# EAGLE design Daughter2 routed (EAGLE 9.6.2)
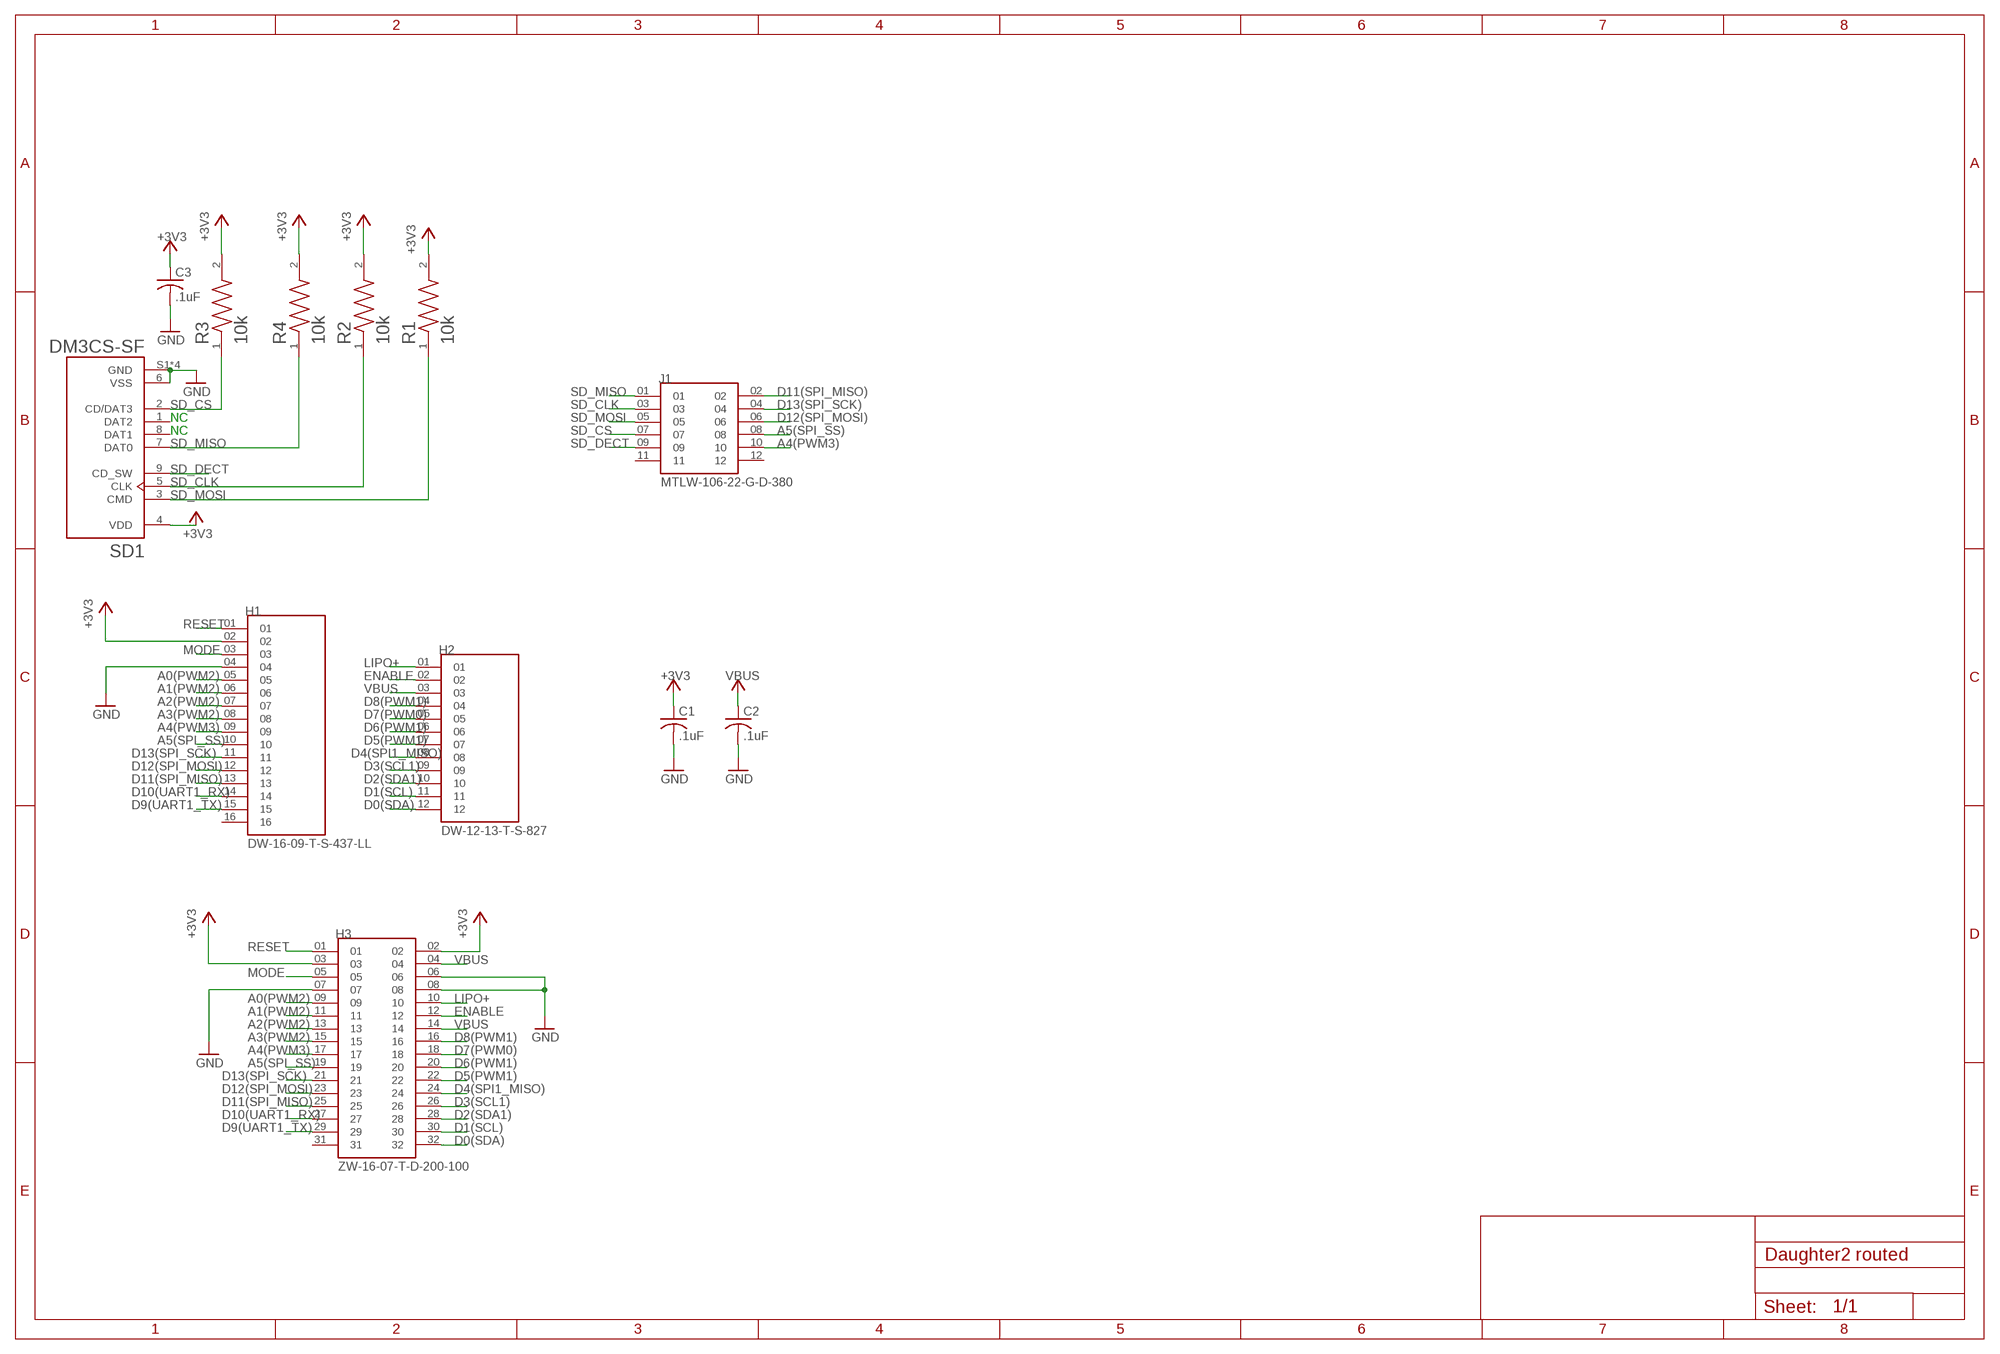
[diagram p0: schematic, sheet 1]

## Parts
C1  .1uF  C-US025-030X050  [C025-030X050]
C2  .1uF  C-US025-030X050  [C025-030X050]
C3  .1uF  C-US025-030X050  [C025-030X050]
H1  DW-16-09-T-S-437-LL  [SAMTEC_DW-16-09-T-S-437-LL]
H2  DW-12-13-T-S-827  [SAMTEC_DW-12-13-T-S-827]
H3  ZW-16-07-T-D-200-100  [SAMTEC_ZW-16-07-T-D-200-100]
J1  MTLW-106-22-G-D-380  [SAMTEC_MTLW-106-22-G-D-380]
R1  10k  1623927-4  [RESAD700W45L350D185]
R2  10k  1623927-4  [RESAD700W45L350D185]
R3  10k  1623927-4  [RESAD700W45L350D185]
R4  10k  1623927-4  [RESAD700W45L350D185]
SD1  DM3CS-SF  [HRS_DM3CS-SF]

## Nets
+3V3: C1.1 C3.1 H1.02 H3.02 H3.03 R1.2 R2.2 R3.2 R4.2 SD1.4(VDD)
A0(PWM2): H1.05 H3.09
A1(PWM2): H1.06 H3.11
A2(PWM2): H1.07 H3.13
A3(PWM2): H1.08 H3.15
A4(PWM3): H1.09 H3.17 J1.10
A5(SPI_SS): H1.10 H3.19 J1.08
D0(SDA): H2.12 H3.32
D1(SCL): H2.11 H3.30
D2(SDA1): H2.10 H3.28
D3(SCL1): H2.09 H3.26
D4(SPI1_MISO): H2.08 H3.24
D5(PWM1): H2.07 H3.22
D6(PWM1): H2.06 H3.20
D7(PWM0): H2.05 H3.18
D8(PWM1): H2.04 H3.16
D9(UART1_TX): H1.15 H3.29
D10(UART1_RX): H1.14 H3.27
D11(SPI_MISO): H1.13 H3.25 J1.02
D12(SPI_MOSI): H1.12 H3.23 J1.06
D13(SPI_SCK): H1.11 H3.21 J1.04
ENABLE: H2.02 H3.12
GND: C1.2 C2.2 C3.2 H1.04 H3.06 H3.07 H3.08 SD1.6(VSS) SD1.S1(GND) SD1.S2(GND) SD1.S3(GND) SD1.S5(GND)
LIPO+: H2.01 H3.10
MODE: H1.03 H3.05
RESET: H1.01 H3.01
SD_CLK: J1.03 R2.1 SD1.5(CLK)
SD_CS: J1.07 R3.1 SD1.2(CD/DAT3)
SD_DECT: J1.09 SD1.9(CD_SW)
SD_MISO: J1.01 R4.1 SD1.7(DAT0)
SD_MOSI: J1.05 R1.1 SD1.3(CMD)
VBUS: C2.1 H2.03 H3.04 H3.14 ; supply symbol labelled VCC
Unconnected: H1.16 H3.31 J1.11 J1.12 SD1.1(DAT2) SD1.8(DAT1)

## Notes on the sheet
- NC
- NC

## Library data of the parts
C1-C3 = rcl:C-US: CAPACITOR, American symbol; SPICEPREFIX: C
H1 = DW-16-09-T-S-437-LL:DW-16-09-T-S-437-LL: Check availability <https://pricing.snapeda.com/parts/DW-16-09-T-S-437-LL/Samtec/view-part?ref=eda>; AVAILABILITY: In Stock; DESCRIPTION: 16 Position Header Spacer Connector 0.100 (2.54mm) Tin Through Hole; MF: Samtec; MP: DW-16-09-T-S-437-LL; PACKAGE: None; PRICE: None; PURCHASE-URL: https://pricing.snapeda.com/search/part/DW-16-09-T-S-437-LL/?ref=eda
H2 = DW-12-13-T-S-827:DW-12-13-T-S-827: Check availability <https://pricing.snapeda.com/parts/DW-12-13-T-S-827/Samtec%20Inc./view-part?ref=eda>; AVAILABILITY: In Stock; DESCRIPTION: 12 Position Header Spacer Connector 0.100 (2.54mm) Tin Through Hole; MF: Samtec Inc.; MP: DW-12-13-T-S-827; PACKAGE: None; PRICE: None; PURCHASE-URL: https://pricing.snapeda.com/search/part/DW-12-13-T-S-827/?ref=eda
H3 = ZW-16-07-T-D-200-100:ZW-16-07-T-D-200-100: Check availability <https://pricing.snapeda.com/parts/ZW-16-07-T-D-200-100/Samtec%20Inc./view-part?ref=eda>; AVAILABILITY: In Stock; DESCRIPTION: 32 Position Header Spacer Connector 0.100 (2.54mm) Tin Through Hole; MF: Samtec Inc.; MP: ZW-16-07-T-D-200-100; PACKAGE: None; PRICE: None; PURCHASE-URL: https://pricing.snapeda.com/search/part/ZW-16-07-T-D-200-100/?ref=eda
J1 = MTLW-106-22-G-D-380:MTLW-106-22-G-D-380: Check availability <https://pricing.snapeda.com/parts/MTLW-106-22-G-D-380/Samtec/view-part?ref=eda>; AVAILABILITY: In Stock; DESCRIPTION: CONN HEADER VERT 12POS 2.54MM; MF: Samtec; MP: MTLW-106-22-G-D-380; PACKAGE: None; PRICE: None; PURCHASE-URL: https://pricing.snapeda.com/search/part/MTLW-106-22-G-D-380/?ref=eda
R1-R4 = 1623927-4:1623927-4: CFR16 5% 10K Check availability <https://pricing.snapeda.com/parts/1623927-4/TE%20Connectivity/view-part?ref=eda>; AVAILABILITY: In Stock; COMMENT: 1623927-4; DESCRIPTION: 10 kOhms ±5% 0.25W, 1/4W Through Hole Resistor Axial - Carbon Film; MF: TE Connectivity; MP: 1623927-4; PACKAGE: None; POWER_RATING: .25 W; PRICE: None; RESISTANCE: 10K; TOLERANCE: 5%; VOLTAGE_RATING: 200 V
SD1 = DM3CS-SF:DM3CS-SF: CONN MICRO SD CARD HINGED TYPE Check availability <https://pricing.snapeda.com/parts/DM3CS-SF/Hirose/view-part?ref=eda>; AVAILABILITY: In Stock; DESCRIPTION: 10 (8 + 2) Position Card Connector Secure Digital - microSD™ Surface Mount, Right Angle Gold; MF: Hirose; MP: DM3CS-SF; PACKAGE: None; PRICE: None; PURCHASE-URL: https://pricing.snapeda.com/search/part/DM3CS-SF/?ref=eda

## Net classes
0 default: width 0.305 mm, drill 0.508 mm, clearance 0.254 mm

## Board
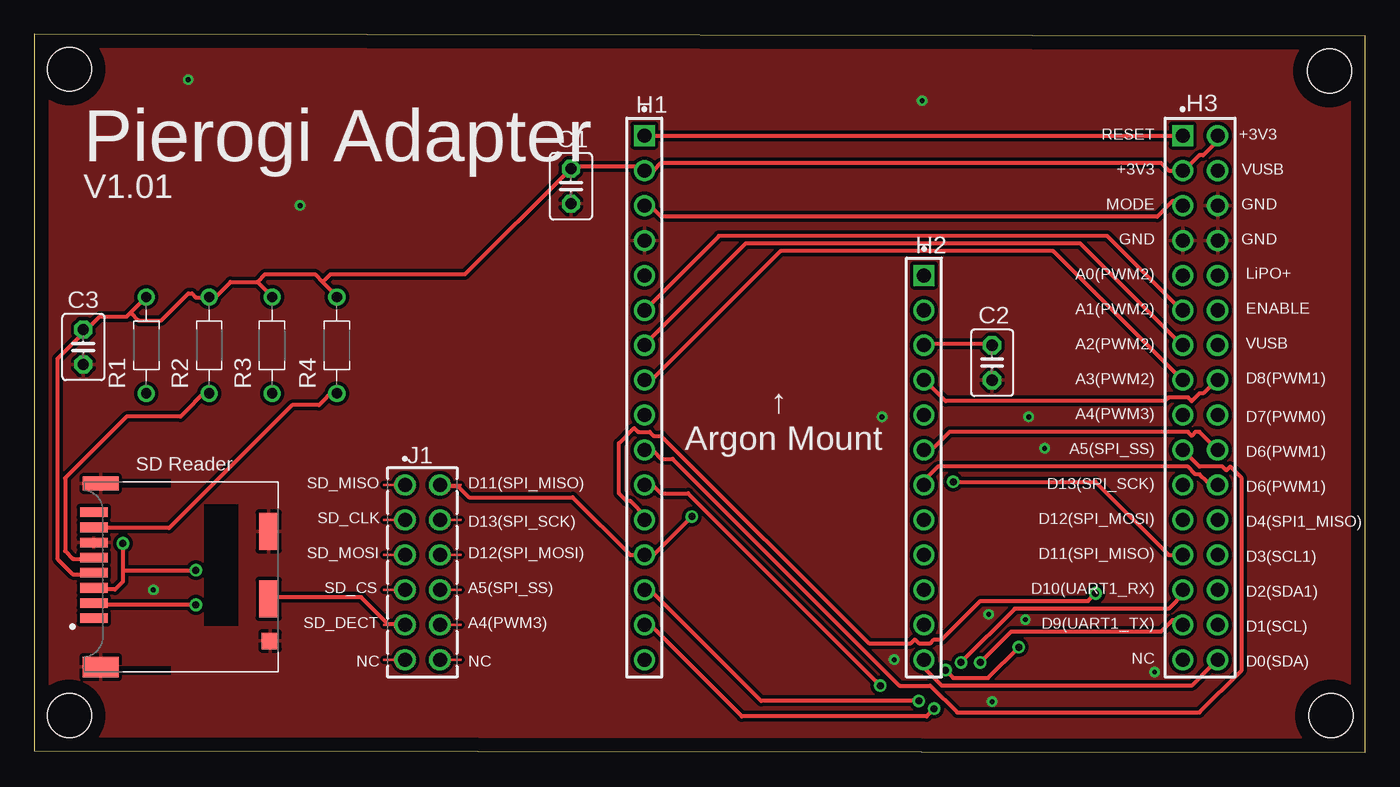
[diagram p1: board, top side]
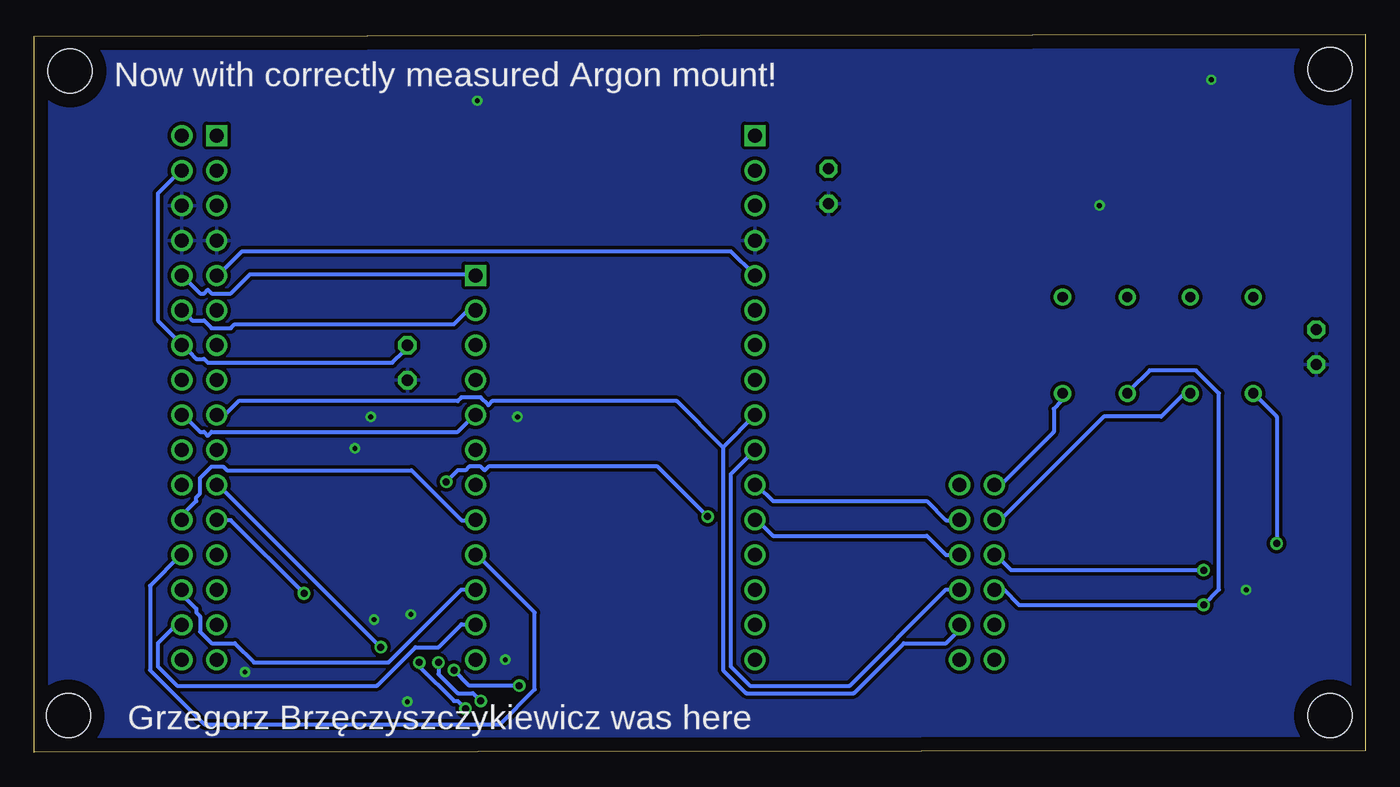
[diagram p2: board, bottom side, seen from below]

Size 96.7 x 52.19 mm. Coordinates in mm from the lower left corner, seen from the top.
Outline: 0,0.13 96.7,0 96.7,52.06 0,52.19 0,0.13
Copper layers (1*16): Top 0.035mm / dielectric 1.5mm / Bottom 0.035mm
Design rules "default": minimum track width 6mil, minimum drill 0.35mm, track to track 6mil, track to pad 6mil, pad to pad 6mil, via to via 6mil, smd to smd 6mil, copper to edge 40mil, drill to drill 6mil, minimum pad ring 10mil, minimum via ring 8mil, stop-mask expansion 4mil, vias tented up to drill 0mil, thermal gap 10mil
Holes 3.2 mm at 2.54,49.66 94.11,49.53 2.54,2.67 94.23,2.67

### Footprints (pad centres in the part's own frame; a part is rotated, then mirrored left to right if it is on the bottom)
C025-030X050 = drill 0.813 octagon: 1 -1.27,0; 2 1.27,0
SAMTEC_DW-16-09-T-S-437-LL = drill 1.02 pad 1.37 square: 01 0,0 | drill 1.02 pad 1.37: 02 2.54,0; 03 5.08,0; 04 7.62,0; 05 10.16,0; 06 12.7,0; 07 15.24,0; 08 17.78,0; 09 20.32,0; 10 22.86,0; 11 25.4,0; 12 27.94,0; 13 30.48,0; 14 33.02,0; 15 35.56,0; 16 38.1,0
SAMTEC_DW-12-13-T-S-827 = drill 1.02 pad 1.37 square: 01 0,0 | drill 1.02 pad 1.37: 02 2.54,0; 03 5.08,0; 04 7.62,0; 05 10.16,0; 06 12.7,0; 07 15.24,0; 08 17.78,0; 09 20.32,0; 10 22.86,0; 11 25.4,0; 12 27.94,0
SAMTEC_ZW-16-07-T-D-200-100 = drill 1.02 pad 1.37 square: 01 0,0 | drill 1.02 pad 1.37: 02 0,2.54; 03 2.54,0; 04 2.54,2.54; 05 5.08,0; 06 5.08,2.54; 07 7.62,0; 08 7.62,2.54; 09 10.16,0; 10 10.16,2.54; 11 12.7,0; 12 12.7,2.54; 13 15.24,0; 14 15.24,2.54; 15 17.78,0; 16 17.78,2.54; 17 20.32,0; 18 20.32,2.54; 19 22.86,0; 20 22.86,2.54; 21 25.4,0; 22 25.4,2.54; 23 27.94,0; 24 27.94,2.54; 25 30.48,0; 26 30.48,2.54; 27 33.02,0; 28 33.02,2.54; 29 35.56,0; 30 35.56,2.54; 31 38.1,0; 32 38.1,2.54
SAMTEC_MTLW-106-22-G-D-380 = drill 1.02 pad 1.52: 01 -6.35,-1.27; 02 -6.35,1.27; 03 -3.81,-1.27; 04 -3.81,1.27; 05 -1.27,-1.27; 06 -1.27,1.27; 07 1.27,-1.27; 08 1.27,1.27; 09 3.81,-1.27; 10 3.81,1.27; 11 6.35,-1.27; 12 6.35,1.27
RESAD700W45L350D185 = drill 0.75: 1 -3.5,0; 2 3.5,0
HRS_DM3CS-SF = smd 0.7 x 2: 1 3.2,-6.35; 2 2.1,-6.35; 3 1,-6.35; 4 -0.1,-6.35; 5 -1.2,-6.35; 6 -2.3,-6.35; 7 -3.4,-6.35; 8 -4.5,-6.35 | smd 2.7 x 1.4: 9 1.8,6.35; S3 -3.1,6.35 | smd 1 x 2.6: S1 -6.6,-5.85 | smd 1.5 x 2.6: S2 6.75,-5.85 | smd 1.2 x 1.2: S5 4.85,6.45

### Placement (x,y rotation side)
C1  38.99,41.15 270 top
C2  69.6,28.32 270 top
C3  3.56,29.46 270 top
H1  44.32,44.83 270 top
H2  64.64,34.67 270 top
H3  83.44,44.83 270 top
J1  28.19,13.08 270 top
R1  8.13,29.59 90 top
R2  12.7,29.59 90 top
R3  17.27,29.59 90 top
R4  21.97,29.59 90 top
SD1  10.67,12.95 270 top

### Tracks (layer width: path | path; a pad name or v marks a point on that pad's centre or on a via)
+3V3
  Top 0.305: H3.02 85.78,44.81 85.78,44.25 84.94,43.41 84.66,43.41 83.54,42.29 H3.03 82.42,42.29 81.86,42.85 45.54,42.85 44.98,42.29 H1.02 44.15,42.29 43.87,42.57 39.12,42.57 C1.1 38.84,42.29 31.29,34.75 21.51,34.75 20.95,34.19 | 3.63,30.56 1.68,28.6 1.68,14.07 2.79,12.95 4.19,12.95 SD1.4 | 6.99,31.95 6.71,31.67 4.75,31.67 3.63,30.56 | 6.99,31.95 8.1,33.07 R1.2 | 3.63,30.56 C3.1 | 6.99,31.95 7.54,31.39 9.22,31.39 11.18,33.35 11.46,33.35 11.73,33.07 12.57,33.07 R2.2 12.85,33.07 13.13,33.07 14.25,34.19 16.2,34.19 | 16.2,34.19 17.04,33.35 R3.2 | 20.95,34.19 20.4,34.75 16.76,34.75 16.2,34.19 | 20.95,34.19 21.79,33.35 R4.2
A0(PWM2)
  Bottom 0.305: H1.05 44.42,34.75 46.1,36.42 81.58,36.42 83.26,34.75 H3.09
A1(PWM2)
  Top 0.305: H1.06 49.73,37.54 77.95,37.54 83.26,32.23 H3.11
A2(PWM2)
  Top 0.305: H1.07 44.42,29.72 51.69,36.98 76,36.98 83.26,29.72 H3.13
A3(PWM2)
  Top 0.305: H1.08 44.42,27.2 44.98,27.2 54.2,36.42 74.04,36.42 82.98,27.48 83.26,27.48 83.54,27.2 H3.15
A4(PWM3)
  Bottom 0.305: 46.66,22.17 46.66,5.97 44.98,4.29 37.16,4.29 33.53,7.92 30.45,7.92 29.62,8.76 29.62,9.04 J1.10 | H1.09 46.66,22.17 | 46.66,22.17 50.01,25.53 63.42,25.53 63.7,25.25 64.26,25.81 65.66,25.81 65.94,25.53 81.86,25.53 82.7,24.69 83.26,24.69 H3.17
A5(SPI_SS)
  Top 0.305: H3.19 83.54,21.89 84.66,20.78 86.33,20.78 86.61,20.5 86.89,20.78 87.73,19.94 87.73,5.97 84.66,2.9 67.06,2.9 65.1,4.85 62.87,4.85 46.38,21.34 45.54,21.34 44.98,21.89 44.42,21.89 H1.10
  Bottom 0.305: J1.08 29.62,11.84 30.45,11.84 37.44,4.85 44.7,4.85 46.1,6.25 46.1,20.22 44.42,21.89 H1.10
D0(SDA)
  Top 0.305: H2.12 64.82,6.53 64.82,5.97 65.94,4.85 84.1,4.85 85.5,6.25 85.5,6.53 85.78,6.81 H3.32
D1(SCL)
  Bottom 0.305: H2.11 64.82,9.32 65.66,9.32 67.33,7.64 69.01,7.64 71.81,4.85 86.33,4.85 87.73,6.25 87.73,7.92 86.61,9.04 86.06,9.04 H3.30
D2(SDA1)
  Bottom 0.305: H2.10 64.82,11.84 65.66,11.84 70.97,6.53 80.75,6.53 82.14,7.92 83.82,7.92 84.66,8.76 84.66,9.88 84.94,10.16 84.94,10.44 86.06,11.56 H3.28
D3(SCL1)
  Bottom 0.305: H2.09 64.54,14.35 60.35,10.16 60.35,4.57 62.87,2.06 84.38,2.06 88.29,5.97 88.29,12.12 86.06,14.35 H3.26
D4(SPI1_MISO)
  Bottom 0.305: H2.08 64.82,16.87 65.66,16.87 69.29,20.5 82.7,20.5 82.98,20.78 83.82,20.78 84.66,19.94 84.66,18.82 84.94,18.54 84.94,18.26 86.06,17.14 H3.24
D5(PWM1)
  Top 0.305: H2.07 64.82,19.66 64.82,19.94 65.66,20.78 83.82,20.78 84.38,20.22 84.66,20.22 85.22,19.66 85.78,19.66 H3.22
D6(PWM1)
  Top 0.305: H2.06 64.82,22.17 65.38,22.17 66.5,23.29 83.82,23.29 84.1,23.01 84.38,23.29 84.66,23.29 85.5,22.45 85.78,22.45 86.06,22.17 H3.20
D7(PWM0)
  Bottom 0.305: H2.05 64.82,24.41 65.94,23.29 83.82,23.29 84.1,23.01 84.38,23.29 84.66,23.29 85.78,24.41 H3.18
D8(PWM1)
  Top 0.305: H2.04 64.82,26.92 66.22,25.53 82.14,25.53 82.42,25.81 83.82,25.81 84.1,25.53 84.66,26.09 84.94,26.09 85.5,26.64 85.5,26.92 85.78,27.2 H3.16
D9(UART1_TX)  (via drill 0.51)
  Top 0.305: v65.38,3.17 64.82,2.62 51.41,2.62 44.98,9.04 44.42,9.04 H1.15 | v68.73,6.53 70.97,8.76 81.86,8.76 82.7,9.6 82.98,9.6 83.26,9.32 H3.29
  Bottom 0.305: v65.38,3.17 65.94,3.73 66.22,3.73 68.73,6.25 v68.73,6.53
D10(UART1_RX)  (via drill 0.51)
  Top 0.305: v64.26,3.73 52.81,3.73 44.98,11.56 44.42,11.56 H1.14 | v67.33,6.53 71.25,10.44 82.42,10.44 83.54,11.56 H3.27
  Bottom 0.305: v64.26,3.73 64.82,4.29 65.94,4.29 67.33,5.69 v67.33,6.53
D11(SPI_MISO)  (via drill 0.51)
  Top 0.305: J1.02 29.62,19.38 30.73,19.38 31.57,18.54 39.12,18.54 43.31,14.35 H1.13 44.98,14.35 v47.78,17.14 | H3.25 82.42,14.35 77.11,19.66 v66.78,19.66
  Bottom 0.305: v66.78,19.66 65.94,20.5 65.38,20.5 65.1,20.78 64.26,20.78 63.98,20.5 63.7,20.78 51.41,20.78 v47.78,17.14
D12(SPI_MOSI)  (via drill 0.51)
  Top 0.305: v77.11,11.56 76.56,11 68.73,11 65.94,8.2 65.38,8.2 65.1,7.92 64.26,7.92 63.98,8.2 63.7,7.92 60.63,7.92 45.54,23.01 44.98,23.01 44.7,23.29 43.87,23.29 43.59,23.57 42.47,22.45 42.47,18.82 43.03,18.26 43.31,18.26 44.42,17.14 H1.12
  Bottom 0.305: J1.06 30.45,14.35 31.85,15.75 43.03,15.75 44.15,16.87 H1.12 | v77.11,11.56 82.42,16.87 83.26,16.87 H3.23
D13(SPI_SCK)  (via drill 0.51)
  Top 0.305: v71.53,7.64 69.29,5.41 66.78,5.41 v66.22,5.97 | v61.47,4.85 47.5,18.82 45.54,18.82 44.98,19.38 44.42,19.38 H1.11
  Bottom 0.305: J1.04 29.62,16.87 30.45,16.87 31.85,18.26 43.03,18.26 44.15,19.38 H1.11 | v71.53,7.64 83.26,19.38 H3.21 | v66.22,5.97 65.1,4.85 v61.47,4.85
ENABLE
  Bottom 0.305: H2.02 64.82,31.95 65.38,31.95 66.22,31.12 82.14,31.12 82.42,30.84 83.82,30.84 84.38,31.39 85.22,31.39 85.5,31.67 85.5,31.95 85.78,32.23 H3.12
GND  (via drill 0.35)
  other vias: 11.18,48.9 19.3,39.75 64.52,47.37 69.6,3.68 8.64,11.81 62.48,6.73 69.34,10.03 72.01,9.65 73.41,22.1 72.26,24.38 61.59,24.38 81.41,5.84
  pour Top: -1.27,53.47 100.08,53.47 100.08,-1.14 -1.27,-1.14
  pour Bottom: -2.54,54.74 101.85,54.74 101.85,-2.41 -2.54,-2.41
LIPO+
  Bottom 0.305: H2.01 64.82,34.75 81.03,34.75 82.42,33.35 83.82,33.35 84.1,33.63 84.38,33.35 84.66,33.35 85.5,34.19 85.5,34.47 85.78,34.75 H3.10
MODE
  Top 0.305: H1.03 44.42,39.5 44.98,39.5 45.54,38.94 81.58,38.94 82.7,40.06 82.98,40.06 83.26,39.78 H3.05
RESET
  Top 0.305: H1.01 44.42,44.81 83.26,44.81 H3.01
SD_CLK
  Top 0.305: SD1.5 4.19,14.07 2.79,14.07 2.23,14.63 2.23,19.94 6.71,24.41 10.62,24.41 12.57,26.37 R2.1
  Bottom 0.305: J1.03 26.82,17.14 26.26,17.14 19,24.41 14.81,24.41 12.85,26.37 R2.1
SD_CS  (via drill 0.51)
  Top 0.305: v11.73,10.72 4.47,10.72 SD1.2
  Bottom 0.305: J1.07 26.82,11.84 26.26,11.84 25.15,10.72 v11.73,10.72 10.62,11.84 10.62,26.09 12.29,27.76 15.65,27.76 17.04,26.37 R3.1
SD_DECT
  Top 0.305: SD1.9 17.04,11.28 23.75,11.28 25.7,9.32 26.82,9.32 J1.09
SD_MISO
  Top 0.305: SD1.7 4.47,16.31 9.78,16.31 18.72,25.25 20.68,25.25 21.79,26.37 R4.1
  Bottom 0.305: J1.01 26.82,19.66 26.26,19.66 22.63,23.29 22.63,24.97 22.07,25.53 22.07,26.09 R4.1
SD_MOSI  (via drill 0.51)
  Top 0.305: v6.43,15.19 6.43,13.23 | 6.43,13.23 6.43,12.39 5.87,11.84 4.47,11.84 SD1.3 | 6.43,13.23 v11.73,13.23
  Bottom 0.305: v6.43,15.19 6.43,24.41 8.1,26.09 R1.1 | v11.73,13.23 25.7,13.23 26.82,14.35 J1.05
VBUS
  Top 0.305: C2.1 69.57,29.72 64.82,29.72 H2.03
  Bottom 0.305: H3.04 86.06,42.29 87.73,40.62 87.73,31.39 86.06,29.72 H3.14 85.78,29.72 85.5,29.44 85.5,29.16 84.94,28.6 84.38,28.6 84.1,28.32 70.69,28.32 69.85,29.16 69.85,29.44 C2.1

### Text on the board
tNames: RESET | +3V3 | +3V3 | VUSB | V1.01 | MODE | GND | Pierogi Adapter | GND | GND | A0(PWM2) | LiPO+ | A1(PWM2) | ENABLE | A2(PWM2) | VUSB | A3(PWM2) | D8(PWM1) | A4(PWM3) | D7(PWM0) | A5(SPI_SS) | ↑ / Argon Mount | D6(PWM1) | SD Reader | SD_MISO | D11(SPI_MISO) | D13(SPI_SCK) | D6(PWM1) | D12(SPI_MOSI) | SD_CLK | D13(SPI_SCK) | D4(SPI1_MISO) | D11(SPI_MISO) | SD_MOSI | D12(SPI_MOSI) | D3(SCL1) | D10(UART1_RX) | SD_CS | A5(SPI_SS) | D2(SDA1) | D9(UART1_TX) | SD_DECT | A4(PWM3) | D1(SCL) | NC | NC | NC | D0(SDA)
bNames: Now with correctly measured Argon mount! | Grzegorz Brzęczyszczykiewicz was here